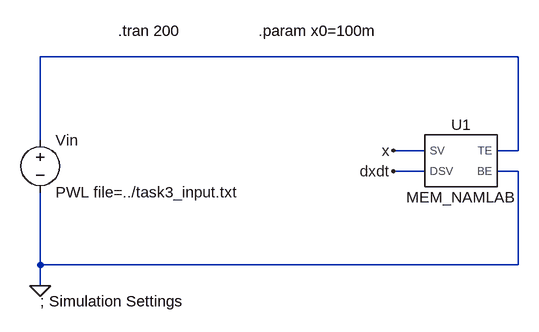
[diagram p0: schematic mem_circuit.asc]
mem_circuit.asc, the LTspice schematic file:
Version 4
SHEET 1 1352 680
WIRE 528 -160 -208 -160
WIRE -208 -32 -208 -160
WIRE 384 -16 336 -16
WIRE 528 -16 528 -160
WIRE 528 -16 496 -16
WIRE 384 16 336 16
WIRE 528 16 496 16
WIRE -208 160 -208 48
WIRE 528 160 528 16
WIRE 528 160 -208 160
WIRE -208 192 -208 160
FLAG -208 192 0
FLAG 336 -16 x
FLAG 336 16 dxdt
SYMBOL voltage -208 -48 R0
WINDOW 123 0 0 Left 0
WINDOW 39 0 0 Left 0
SYMATTR InstName Vin
SYMATTR Value PWL file=../task3_input.txt
SYMBOL MEM_NAMLAB 432 0 R0
SYMATTR InstName U1
TEXT -88 -200 Left 2 !.tran 200
TEXT 128 -200 Left 2 !.param x0=100m
TEXT -208 216 Left 2 !; Simulation Settings

The netlist it stands for:
* mem_circuit.asc
Vin N001 0 PWL file=../task3_input.txt
XU1 N001 0 x dxdt MEM_NAMLAB  ; pins TE BE SV DSV
.tran 200
.param x0=100m
; Simulation Settings
.lib .\MEM_NAMLAB.cir
.backanno
.end